# Altium schematic sheet Block Diagram.SchDoc: Block Diagram
size A4; DrawnBy: Manh Ngo Van; Engineer: Manh Ngo Van; Organization: Altium Limited; Address1: L3, 12a Rodborough Rd; Address2: Frenchs Forest; Address3: NSW; Address4: Australia 2086; DocumentNumber: 1; Revision: 1.0; SheetNumber: 1; SheetTotal: 3
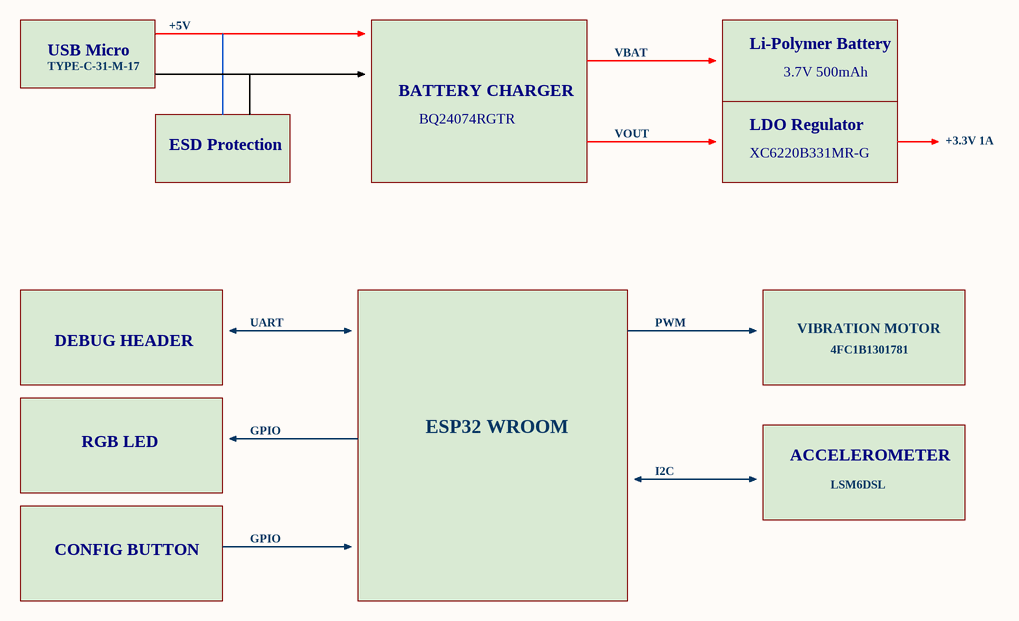
[diagram p0: Block Diagram.SchDoc]

## Notes on the sheet
- USB Micro
- TYPE-C-31-M-17
- +5V
- VBAT
- Li-Polymer Battery
- BATTERY CHARGER
- BQ24074RGTR
- VOUT
- LDO Regulator
- 3.7V 500mAh
- +3.3V 1A
- ESD Protection
- XC6220B331MR-G
- UART
- PWM
- VIBRATION MOTOR
- DEBUG HEADER
- 4FC1B1301781
- RGB LED
- GPIO
- ESP32 WROOM
- I2C
- ACCELEROMETER
- LSM6DSL
- CONFIG BUTTON
- Address: 90 Nguyen Tuan Street, Thanh Xuan
- Hanoi - Vietnam
- Title:
- Size
- Document Number:
- Engineer:
- Drawn By:
- Rev:
- Date:
- A4
- Sheet
- of